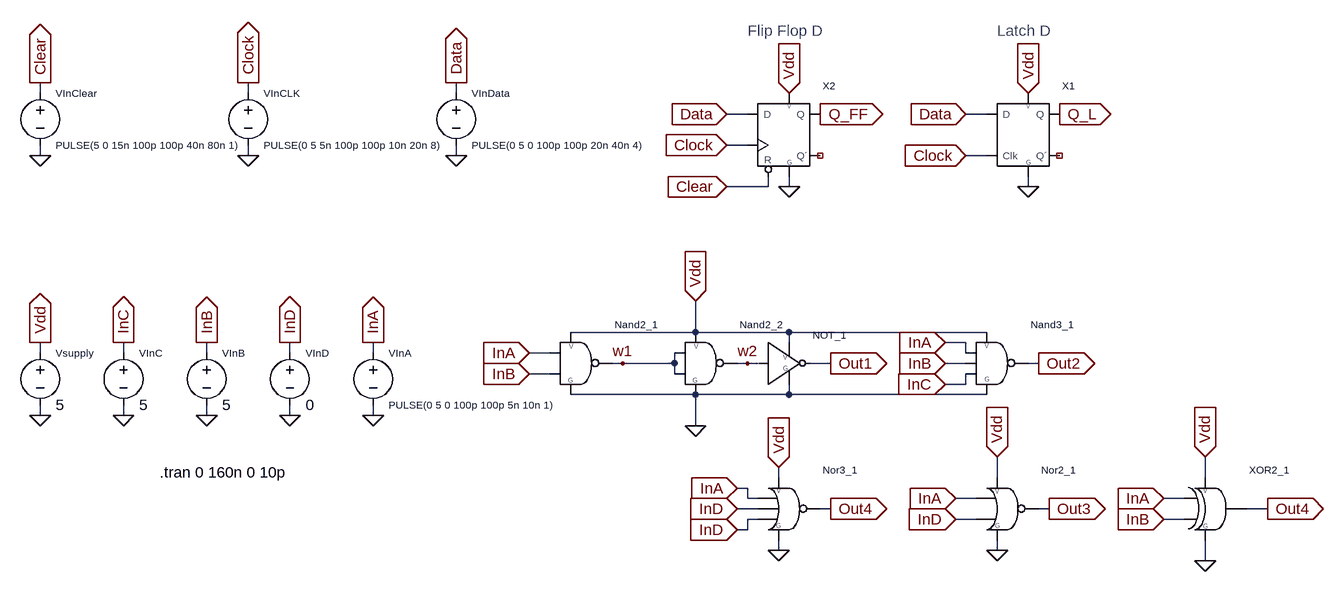
[diagram p0: schematic CircuitExample.asc]
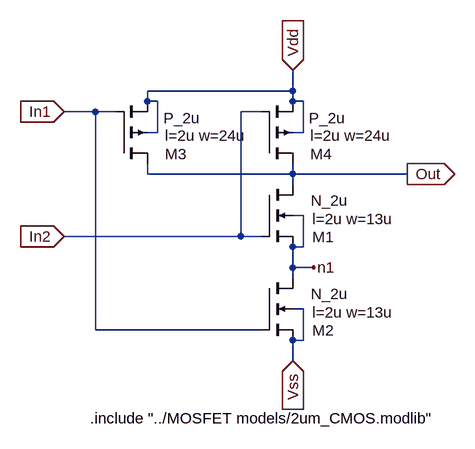
[diagram p1: sub-circuit nand2.asc]
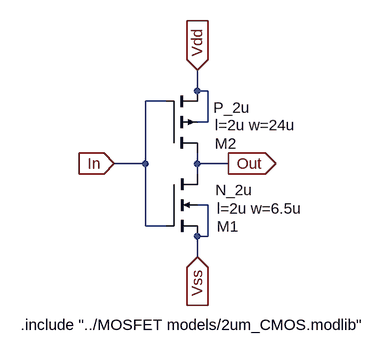
[diagram p2: sub-circuit not.asc]
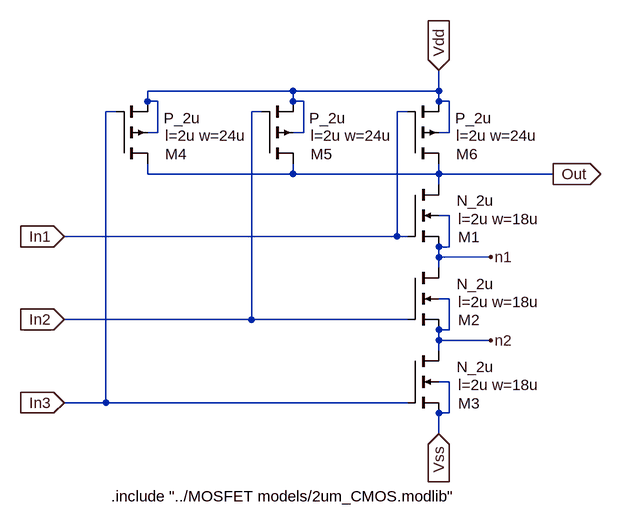
[diagram p3: sub-circuit nand3.asc]
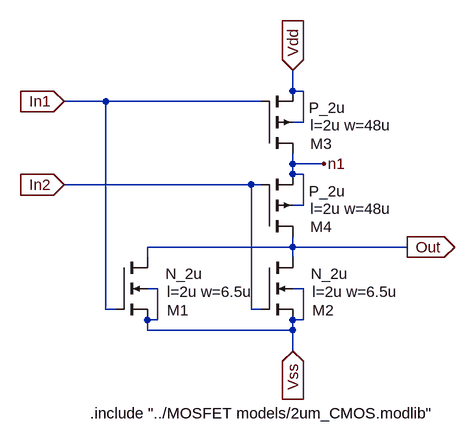
[diagram p4: sub-circuit nor2.asc]
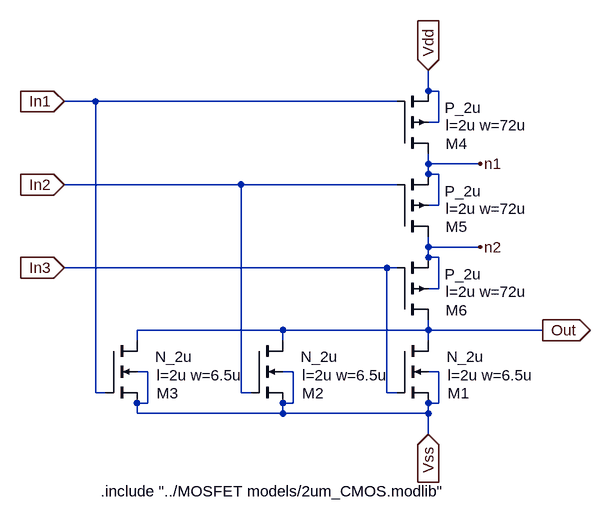
[diagram p5: sub-circuit nor3.asc]
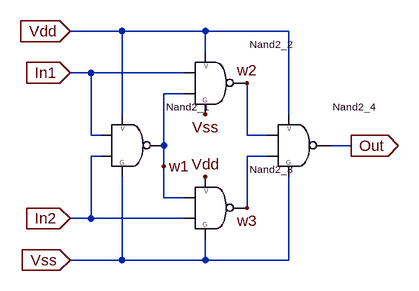
[diagram p6: sub-circuit xor2.asc]
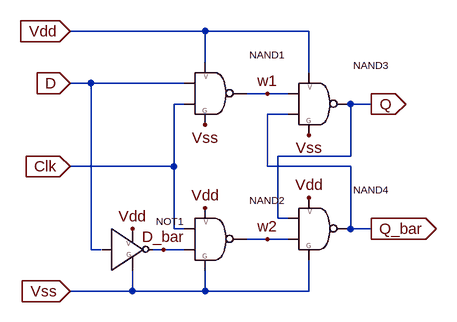
[diagram p7: sub-circuit d_latch.asc]
CircuitExample.asc, the LTspice schematic file:
Version 4
SHEET 1 1284 680
WIRE -784 -272 -784 -288
WIRE -464 -272 -464 -288
WIRE -144 -272 -144 -288
WIRE 304 -240 272 -240
WIRE 672 -240 640 -240
WIRE 304 -192 272 -192
WIRE -784 -176 -784 -192
WIRE -464 -176 -464 -192
WIRE -144 -176 -144 -192
WIRE 672 -176 640 -176
WIRE 336 -128 336 -144
WIRE 336 -128 272 -128
WIRE 368 -128 368 -144
WIRE 736 -128 736 -144
WIRE 224 96 224 48
WIRE 224 96 32 96
WIRE 368 96 224 96
WIRE 672 96 368 96
WIRE 368 112 368 96
WIRE 640 112 608 112
WIRE -784 128 -784 112
WIRE -656 128 -656 112
WIRE -528 128 -528 112
WIRE -400 128 -400 112
WIRE -272 128 -272 112
WIRE 0 128 -32 128
WIRE 640 128 640 112
WIRE 112 144 96 144
WIRE 192 144 192 128
WIRE 192 144 112 144
WIRE 304 144 288 144
WIRE 320 144 304 144
WIRE 432 144 400 144
WIRE 640 144 608 144
WIRE 752 144 736 144
WIRE 0 160 -32 160
WIRE 192 160 192 144
WIRE 640 176 640 160
WIRE 640 176 608 176
WIRE 224 192 32 192
WIRE 368 192 368 176
WIRE 368 192 224 192
WIRE 672 192 368 192
WIRE -784 224 -784 208
WIRE -656 224 -656 208
WIRE -528 224 -528 208
WIRE -400 224 -400 208
WIRE -272 224 -272 208
WIRE 224 240 224 192
WIRE 352 320 352 304
WIRE 688 320 688 288
WIRE 1008 320 1008 288
WIRE 304 336 288 336
WIRE 304 352 304 336
WIRE 320 352 304 352
WIRE 656 352 624 352
WIRE 976 352 944 352
WIRE 320 368 288 368
WIRE 432 368 416 368
WIRE 768 368 752 368
WIRE 1104 368 1072 368
WIRE 320 384 304 384
WIRE 656 384 624 384
WIRE 976 384 944 384
WIRE 304 400 304 384
WIRE 304 400 288 400
WIRE 352 432 352 416
WIRE 688 432 688 416
WIRE 1008 448 1008 416
FLAG 224 48 Vdd
IOPIN 224 48 In
FLAG 224 240 0
FLAG 112 144 w1
FLAG 304 144 w2
FLAG -32 128 InA
IOPIN -32 128 In
FLAG -32 160 InB
IOPIN -32 160 In
FLAG 432 144 Out1
IOPIN 432 144 Out
FLAG -784 224 0
FLAG -784 112 Vdd
IOPIN -784 112 Out
FLAG -528 224 0
FLAG -528 112 InB
IOPIN -528 112 Out
FLAG -272 224 0
FLAG -272 112 InA
IOPIN -272 112 Out
FLAG 608 112 InA
IOPIN 608 112 In
FLAG 608 144 InB
IOPIN 608 144 In
FLAG 608 176 InC
IOPIN 608 176 In
FLAG -656 224 0
FLAG -656 112 InC
IOPIN -656 112 Out
FLAG 752 144 Out2
IOPIN 752 144 Out
FLAG 688 288 Vdd
IOPIN 688 288 In
FLAG 688 432 0
FLAG 768 368 Out3
IOPIN 768 368 Out
FLAG 624 352 InA
IOPIN 624 352 In
FLAG 624 384 InD
IOPIN 624 384 In
FLAG -400 224 0
FLAG -400 112 InD
IOPIN -400 112 Out
FLAG 352 304 Vdd
IOPIN 352 304 In
FLAG 352 432 0
FLAG 432 368 Out4
IOPIN 432 368 Out
FLAG 288 336 InA
IOPIN 288 336 In
FLAG 288 368 InD
IOPIN 288 368 In
FLAG 288 400 InD
IOPIN 288 400 In
FLAG 944 352 InA
IOPIN 944 352 In
FLAG 944 384 InB
IOPIN 944 384 In
FLAG 1008 288 Vdd
IOPIN 1008 288 In
FLAG 1008 448 0
FLAG 1104 368 Out4
IOPIN 1104 368 Out
FLAG 368 -272 Vdd
IOPIN 368 -272 In
FLAG 736 -272 Vdd
IOPIN 736 -272 In
FLAG 368 -128 0
FLAG 736 -128 0
FLAG 416 -240 Q_FF
IOPIN 416 -240 Out
FLAG 784 -240 Q_L
IOPIN 784 -240 Out
FLAG -144 -176 0
FLAG -144 -288 Data
IOPIN -144 -288 Out
FLAG -464 -176 0
FLAG -464 -288 Clock
IOPIN -464 -288 Out
FLAG 272 -240 Data
IOPIN 272 -240 In
FLAG 640 -240 Data
IOPIN 640 -240 In
FLAG 272 -192 Clock
IOPIN 272 -192 In
FLAG 640 -176 Clock
IOPIN 640 -176 In
FLAG -784 -176 0
FLAG -784 -288 Clear
IOPIN -784 -288 Out
FLAG 272 -128 Clear
IOPIN 272 -128 In
SYMBOL NAND2 16 144 R0
SYMATTR InstName Nand2_1
SYMBOL NAND2 208 144 R0
SYMATTR InstName Nand2_2
SYMBOL NOT 336 144 R0
SYMATTR InstName NOT_1
SYMBOL voltage -784 112 R0
WINDOW 0 24 16 Left 1
WINDOW 123 0 0 Left 0
WINDOW 39 0 0 Left 0
SYMATTR InstName Vsupply
SYMATTR Value 5
SYMBOL voltage -528 112 R0
WINDOW 0 24 16 Left 1
WINDOW 123 0 0 Left 0
WINDOW 39 0 0 Left 0
SYMATTR InstName VInB
SYMATTR Value 5
SYMBOL voltage -272 112 R0
WINDOW 0 24 16 Left 1
WINDOW 3 24 96 Left 1
WINDOW 123 0 0 Left 0
WINDOW 39 0 0 Left 0
SYMATTR InstName VInA
SYMATTR Value PULSE(0 5 0 100p 100p 5n 10n 1)
SYMBOL NAND3 656 144 R0
SYMATTR InstName Nand3_1
SYMBOL voltage -656 112 R0
WINDOW 0 24 16 Left 1
WINDOW 123 0 0 Left 0
WINDOW 39 0 0 Left 0
SYMATTR InstName VInC
SYMATTR Value 5
SYMBOL NOR2 672 368 R0
SYMATTR InstName Nor2_1
SYMBOL voltage -400 112 R0
WINDOW 0 24 16 Left 1
WINDOW 123 0 0 Left 0
WINDOW 39 0 0 Left 0
SYMATTR InstName VInD
SYMATTR Value 0
SYMBOL NOR3 336 368 R0
SYMATTR InstName Nor3_1
SYMBOL XOR2 992 368 R0
SYMATTR InstName XOR2_1
SYMBOL D_latch 656 -208 R0
SYMATTR InstName X1
SYMBOL D_FF 288 -208 R0
SYMATTR InstName X2
SYMBOL voltage -144 -288 R0
WINDOW 0 24 16 Left 1
WINDOW 3 24 96 Left 1
WINDOW 123 0 0 Left 0
WINDOW 39 0 0 Left 0
SYMATTR InstName VInData
SYMATTR Value PULSE(0 5 0 100p 100p 20n 40n 4)
SYMBOL voltage -464 -288 R0
WINDOW 0 24 16 Left 1
WINDOW 3 24 96 Left 1
WINDOW 123 0 0 Left 0
WINDOW 39 0 0 Left 0
SYMATTR InstName VInCLK
SYMATTR Value PULSE(0 5 5n 100p 100p 10n 20n 8)
SYMBOL voltage -784 -288 R0
WINDOW 0 24 16 Left 1
WINDOW 3 24 96 Left 1
WINDOW 123 0 0 Left 0
WINDOW 39 0 0 Left 0
SYMATTR InstName VInClear
SYMATTR Value PULSE(5 0 15n 100p 100p 40n 80n 1)
TEXT -600 312 Left 2 !.tran 0 160n 0 10p
TEXT 304 -368 Left 2 ;Flip Flop D
TEXT 688 -368 Left 2 ;Latch D

nand2.asc, the sub-circuit schematic file:
Version 4
SHEET 1 880 680
WIRE 192 48 192 16
WIRE 192 48 -32 48
WIRE -32 64 -32 48
WIRE -16 64 -32 64
WIRE 192 64 192 48
WIRE 208 64 192 64
WIRE -112 80 -160 80
WIRE -80 80 -112 80
WIRE 144 80 112 80
WIRE -16 112 -16 64
WIRE -16 112 -32 112
WIRE 208 112 208 64
WIRE 208 112 192 112
WIRE -32 176 -32 160
WIRE 192 176 192 160
WIRE 192 176 -32 176
WIRE 368 176 192 176
WIRE 192 192 192 176
WIRE 208 240 192 240
WIRE 112 272 112 80
WIRE 112 272 -160 272
WIRE 144 272 112 272
WIRE 208 288 208 240
WIRE 208 288 192 288
WIRE 192 320 192 288
WIRE 224 320 192 320
WIRE 192 336 192 320
WIRE 208 384 192 384
WIRE -112 416 -112 80
WIRE 144 416 -112 416
WIRE 208 432 208 384
WIRE 208 432 192 432
WIRE 192 464 192 432
FLAG 192 16 Vdd
IOPIN 192 16 In
FLAG 192 464 Vss
IOPIN 192 464 In
FLAG -160 80 In1
IOPIN -160 80 In
FLAG -160 272 In2
IOPIN -160 272 In
FLAG 368 176 Out
IOPIN 368 176 Out
FLAG 224 320 n1
SYMBOL nmos4 144 192 R0
WINDOW 0 78 81 Left 2
WINDOW 3 76 25 Left 2
WINDOW 123 78 53 Left 2
SYMATTR InstName M1
SYMATTR Value N_2u
SYMATTR Value2 l=2u w=13u
SYMBOL pmos4 144 160 M180
WINDOW 0 75 15 Left 2
WINDOW 3 73 70 Left 2
WINDOW 123 75 43 Left 2
SYMATTR InstName M4
SYMATTR Value P_2u
SYMATTR Value2 l=2u w=24u
SYMBOL pmos4 -80 160 M180
WINDOW 0 75 15 Left 2
WINDOW 3 73 70 Left 2
WINDOW 123 75 43 Left 2
SYMATTR InstName M3
SYMATTR Value P_2u
SYMATTR Value2 l=2u w=24u
SYMBOL nmos4 144 336 R0
WINDOW 0 78 81 Left 2
WINDOW 3 76 25 Left 2
WINDOW 123 78 53 Left 2
SYMATTR InstName M2
SYMATTR Value N_2u
SYMATTR Value2 l=2u w=13u
TEXT -120 552 Left 2 !.include "../MOSFET models/2um_CMOS.modlib"

not.asc, the sub-circuit schematic file:
Version 4
SHEET 1 880 680
WIRE 192 64 192 32
WIRE 208 64 192 64
WIRE 144 80 112 80
WIRE 208 112 208 64
WIRE 208 112 192 112
WIRE 112 176 112 80
WIRE 112 176 64 176
WIRE 192 176 192 160
WIRE 240 176 192 176
WIRE 192 192 192 176
WIRE 208 240 192 240
WIRE 112 272 112 176
WIRE 144 272 112 272
WIRE 208 288 208 240
WIRE 208 288 192 288
WIRE 192 320 192 288
FLAG 192 32 Vdd
IOPIN 192 32 In
FLAG 192 320 Vss
IOPIN 192 320 In
FLAG 64 176 In
IOPIN 64 176 In
FLAG 240 176 Out
IOPIN 240 176 Out
SYMBOL nmos4 144 192 R0
WINDOW 0 78 81 Left 2
WINDOW 3 76 25 Left 2
WINDOW 123 78 53 Left 2
SYMATTR InstName M1
SYMATTR Value N_2u
SYMATTR Value2 l=2u w=6.5u
SYMBOL pmos4 144 160 M180
WINDOW 0 75 15 Left 2
WINDOW 3 73 70 Left 2
WINDOW 123 75 43 Left 2
SYMATTR InstName M2
SYMATTR Value P_2u
SYMATTR Value2 l=2u w=24u
TEXT -80 424 Left 2 !.include "../MOSFET models/2um_CMOS.modlib"

nand3.asc, the sub-circuit schematic file:
Version 4
SHEET 1 880 872
WIRE -32 48 -256 48
WIRE 192 48 192 16
WIRE 192 48 -32 48
WIRE -256 64 -256 48
WIRE -240 64 -256 64
WIRE -32 64 -32 48
WIRE -16 64 -32 64
WIRE 192 64 192 48
WIRE 208 64 192 64
WIRE -304 80 -320 80
WIRE -80 80 -96 80
WIRE 144 80 128 80
WIRE -240 112 -240 64
WIRE -240 112 -256 112
WIRE -16 112 -16 64
WIRE -16 112 -32 112
WIRE 208 112 208 64
WIRE 208 112 192 112
WIRE -256 176 -256 160
WIRE -32 176 -32 160
WIRE -32 176 -256 176
WIRE 192 176 192 160
WIRE 192 176 -32 176
WIRE 368 176 192 176
WIRE 192 192 192 176
WIRE 208 240 192 240
WIRE 128 272 128 80
WIRE 128 272 -384 272
WIRE 144 272 128 272
WIRE 208 288 208 240
WIRE 208 288 192 288
WIRE 192 304 192 288
WIRE 272 304 192 304
WIRE 192 320 192 304
WIRE 208 368 192 368
WIRE -96 400 -96 80
WIRE -96 400 -384 400
WIRE 144 400 -96 400
WIRE 208 416 208 368
WIRE 208 416 192 416
WIRE 192 432 192 416
WIRE 272 432 192 432
WIRE 192 448 192 432
WIRE 208 496 192 496
WIRE -320 528 -320 80
WIRE -320 528 -384 528
WIRE 144 528 -320 528
WIRE 208 544 208 496
WIRE 208 544 192 544
WIRE 192 576 192 544
FLAG 192 16 Vdd
IOPIN 192 16 In
FLAG 192 576 Vss
IOPIN 192 576 In
FLAG -384 272 In1
IOPIN -384 272 In
FLAG -384 400 In2
IOPIN -384 400 In
FLAG 368 176 Out
IOPIN 368 176 Out
FLAG -384 528 In3
IOPIN -384 528 In
FLAG 272 304 n1
FLAG 272 432 n2
SYMBOL nmos4 144 192 R0
WINDOW 0 78 81 Left 2
WINDOW 3 76 25 Left 2
WINDOW 123 78 53 Left 2
SYMATTR InstName M1
SYMATTR Value N_2u
SYMATTR Value2 l=2u w=18u
SYMBOL pmos4 144 160 M180
WINDOW 0 75 15 Left 2
WINDOW 3 73 70 Left 2
WINDOW 123 75 43 Left 2
SYMATTR InstName M6
SYMATTR Value P_2u
SYMATTR Value2 l=2u w=24u
SYMBOL pmos4 -80 160 M180
WINDOW 0 75 15 Left 2
WINDOW 3 73 70 Left 2
WINDOW 123 75 43 Left 2
SYMATTR InstName M5
SYMATTR Value P_2u
SYMATTR Value2 l=2u w=24u
SYMBOL nmos4 144 448 R0
WINDOW 0 78 81 Left 2
WINDOW 3 76 25 Left 2
WINDOW 123 78 53 Left 2
SYMATTR InstName M3
SYMATTR Value N_2u
SYMATTR Value2 l=2u w=18u
SYMBOL pmos4 -304 160 M180
WINDOW 0 75 15 Left 2
WINDOW 3 73 70 Left 2
WINDOW 123 75 43 Left 2
SYMATTR InstName M4
SYMATTR Value P_2u
SYMATTR Value2 l=2u w=24u
SYMBOL nmos4 144 320 R0
WINDOW 0 78 81 Left 2
WINDOW 3 76 25 Left 2
WINDOW 123 78 53 Left 2
SYMATTR InstName M2
SYMATTR Value N_2u
SYMATTR Value2 l=2u w=18u
TEXT -312 672 Left 2 !.include "../MOSFET models/2um_CMOS.modlib"

nor2.asc, the sub-circuit schematic file:
Version 4
SHEET 1 880 680
WIRE 192 -64 192 -96
WIRE 208 -64 192 -64
WIRE -96 -48 -160 -48
WIRE 144 -48 -96 -48
WIRE 208 -16 208 -64
WIRE 208 -16 192 -16
WIRE 192 48 192 32
WIRE 240 48 192 48
WIRE 192 64 192 48
WIRE 208 64 192 64
WIRE 128 80 -160 80
WIRE 144 80 128 80
WIRE 208 112 208 64
WIRE 208 112 192 112
WIRE 192 176 192 160
WIRE 192 176 -32 176
WIRE 368 176 192 176
WIRE -32 192 -32 176
WIRE 192 192 192 176
WIRE -16 240 -32 240
WIRE 208 240 192 240
WIRE -96 272 -96 -48
WIRE -80 272 -96 272
WIRE 128 272 128 80
WIRE 144 272 128 272
WIRE -16 288 -16 240
WIRE -16 288 -32 288
WIRE 208 288 208 240
WIRE 208 288 192 288
WIRE -32 304 -32 288
WIRE 192 304 192 288
WIRE 192 304 -32 304
WIRE 192 336 192 304
FLAG 192 -96 Vdd
IOPIN 192 -96 In
FLAG 192 336 Vss
IOPIN 192 336 In
FLAG -160 -48 In1
IOPIN -160 -48 In
FLAG -160 80 In2
IOPIN -160 80 In
FLAG 368 176 Out
IOPIN 368 176 Out
FLAG 240 48 n1
SYMBOL nmos4 144 192 R0
WINDOW 0 78 81 Left 2
WINDOW 3 76 25 Left 2
WINDOW 123 78 53 Left 2
SYMATTR InstName M2
SYMATTR Value N_2u
SYMATTR Value2 l=2u w=6.5u
SYMBOL pmos4 144 160 M180
WINDOW 0 75 15 Left 2
WINDOW 3 73 70 Left 2
WINDOW 123 75 43 Left 2
SYMATTR InstName M4
SYMATTR Value P_2u
SYMATTR Value2 l=2u w=48u
SYMBOL pmos4 144 32 M180
WINDOW 0 75 15 Left 2
WINDOW 3 73 70 Left 2
WINDOW 123 75 43 Left 2
SYMATTR InstName M3
SYMATTR Value P_2u
SYMATTR Value2 l=2u w=48u
SYMBOL nmos4 -80 192 R0
WINDOW 0 78 81 Left 2
WINDOW 3 76 25 Left 2
WINDOW 123 78 53 Left 2
SYMATTR InstName M1
SYMATTR Value N_2u
SYMATTR Value2 l=2u w=6.5u
TEXT -120 432 Left 2 !.include "../MOSFET models/2um_CMOS.modlib"

nor3.asc, the sub-circuit schematic file:
Version 4
SHEET 1 880 872
WIRE 192 -192 192 -224
WIRE 208 -192 192 -192
WIRE -320 -176 -368 -176
WIRE 144 -176 -320 -176
WIRE 208 -144 208 -192
WIRE 208 -144 192 -144
WIRE 192 -80 192 -96
WIRE 272 -80 192 -80
WIRE 192 -64 192 -80
WIRE 208 -64 192 -64
WIRE -96 -48 -368 -48
WIRE 144 -48 -96 -48
WIRE 208 -16 208 -64
WIRE 208 -16 192 -16
WIRE 192 48 192 32
WIRE 272 48 192 48
WIRE 192 64 192 48
WIRE 208 64 192 64
WIRE 128 80 -368 80
WIRE 144 80 128 80
WIRE 208 112 208 64
WIRE 208 112 192 112
WIRE -32 176 -256 176
WIRE 192 176 192 160
WIRE 192 176 -32 176
WIRE 368 176 192 176
WIRE -256 192 -256 176
WIRE -32 192 -32 176
WIRE 192 192 192 176
WIRE -240 240 -256 240
WIRE -16 240 -32 240
WIRE 208 240 192 240
WIRE -320 272 -320 -176
WIRE -304 272 -320 272
WIRE -96 272 -96 -48
WIRE -80 272 -96 272
WIRE 128 272 128 80
WIRE 144 272 128 272
WIRE -240 288 -240 240
WIRE -240 288 -256 288
WIRE -16 288 -16 240
WIRE -16 288 -32 288
WIRE 208 288 208 240
WIRE 208 288 192 288
WIRE -256 304 -256 288
WIRE -32 304 -32 288
WIRE -32 304 -256 304
WIRE 192 304 192 288
WIRE 192 304 -32 304
WIRE 192 336 192 304
FLAG 192 -224 Vdd
IOPIN 192 -224 In
FLAG 192 336 Vss
IOPIN 192 336 In
FLAG -368 -176 In1
IOPIN -368 -176 In
FLAG -368 -48 In2
IOPIN -368 -48 In
FLAG 368 176 Out
IOPIN 368 176 Out
FLAG -368 80 In3
IOPIN -368 80 In
FLAG 272 -80 n1
FLAG 272 48 n2
SYMBOL nmos4 144 192 R0
WINDOW 0 78 81 Left 2
WINDOW 3 76 25 Left 2
WINDOW 123 78 53 Left 2
SYMATTR InstName M1
SYMATTR Value N_2u
SYMATTR Value2 l=2u w=6.5u
SYMBOL pmos4 144 160 M180
WINDOW 0 75 15 Left 2
WINDOW 3 73 70 Left 2
WINDOW 123 75 43 Left 2
SYMATTR InstName M6
SYMATTR Value P_2u
SYMATTR Value2 l=2u w=72u
SYMBOL pmos4 144 32 M180
WINDOW 0 75 15 Left 2
WINDOW 3 73 70 Left 2
WINDOW 123 75 43 Left 2
SYMATTR InstName M5
SYMATTR Value P_2u
SYMATTR Value2 l=2u w=72u
SYMBOL nmos4 -304 192 R0
WINDOW 0 78 81 Left 2
WINDOW 3 76 25 Left 2
WINDOW 123 78 53 Left 2
SYMATTR InstName M3
SYMATTR Value N_2u
SYMATTR Value2 l=2u w=6.5u
SYMBOL pmos4 144 -96 M180
WINDOW 0 75 15 Left 2
WINDOW 3 73 70 Left 2
WINDOW 123 75 43 Left 2
SYMATTR InstName M4
SYMATTR Value P_2u
SYMATTR Value2 l=2u w=72u
SYMBOL nmos4 -80 192 R0
WINDOW 0 78 81 Left 2
WINDOW 3 76 25 Left 2
WINDOW 123 78 53 Left 2
SYMATTR InstName M2
SYMATTR Value N_2u
SYMATTR Value2 l=2u w=6.5u
TEXT -312 424 Left 2 !.include "../MOSFET models/2um_CMOS.modlib"

xor2.asc, the sub-circuit schematic file:
Version 4
SHEET 1 880 680
WIRE -48 -80 -128 -80
WIRE 80 -80 -48 -80
WIRE 208 -80 80 -80
WIRE 80 -48 80 -80
WIRE -96 -16 -128 -16
WIRE 48 -16 -96 -16
WIRE 48 16 16 16
WIRE -48 48 -48 -80
WIRE 208 48 208 -80
WIRE -96 80 -96 -16
WIRE -80 80 -96 80
WIRE 144 80 144 0
WIRE 176 80 144 80
WIRE 16 96 16 16
WIRE 304 96 272 96
WIRE -80 112 -96 112
WIRE 176 112 144 112
WIRE 16 128 16 96
WIRE 16 176 16 128
WIRE 48 176 16 176
WIRE 144 192 144 112
WIRE -96 208 -96 112
WIRE -96 208 -128 208
WIRE 48 208 -96 208
WIRE -48 272 -48 144
WIRE -48 272 -128 272
WIRE 80 272 80 240
WIRE 80 272 -48 272
WIRE 208 272 208 144
WIRE 208 272 80 272
FLAG -128 -80 Vdd
IOPIN -128 -80 In
FLAG -128 272 Vss
IOPIN -128 272 In
FLAG -128 -16 In1
IOPIN -128 -16 In
FLAG -128 208 In2
IOPIN -128 208 In
FLAG 304 96 Out
IOPIN 304 96 Out
FLAG 80 144 Vdd
FLAG 80 48 Vss
FLAG 16 128 w1
FLAG 144 0 w2
FLAG 144 192 w3
SYMBOL NAND2 -64 96 R0
SYMATTR InstName Nand2_1
SYMBOL NAND2 64 0 R0
SYMATTR InstName Nand2_2
SYMBOL NAND2 64 192 R0
SYMATTR InstName Nand2_3
SYMBOL NAND2 192 96 R0
SYMATTR InstName Nand2_4

d_latch.asc, the sub-circuit schematic file:
Version 4
SHEET 1 880 680
WIRE 320 -16 112 -16
WIRE 480 -16 320 -16
WIRE 320 32 320 -16
WIRE 480 48 480 -16
WIRE 144 64 112 64
WIRE 288 64 144 64
WIRE 416 80 384 80
WIRE 448 80 416 80
WIRE 288 96 272 96
WIRE 576 96 544 96
WIRE 448 112 416 112
WIRE 544 176 544 96
WIRE 544 176 432 176
WIRE 272 192 272 96
WIRE 272 192 112 192
WIRE 416 192 416 112
WIRE 544 192 416 192
WIRE 432 272 432 176
WIRE 448 272 432 272
WIRE 272 288 272 192
WIRE 288 288 272 288
WIRE 544 288 544 192
WIRE 576 288 544 288
WIRE 416 304 384 304
WIRE 448 304 416 304
WIRE 144 320 144 64
WIRE 160 320 144 320
WIRE 256 320 240 320
WIRE 288 320 256 320
WIRE 208 384 208 352
WIRE 208 384 112 384
WIRE 320 384 320 352
WIRE 320 384 208 384
WIRE 480 384 480 336
WIRE 480 384 320 384
FLAG 112 64 D
IOPIN 112 64 In
FLAG 112 192 Clk
IOPIN 112 192 In
FLAG 112 -16 Vdd
IOPIN 112 -16 In
FLAG 112 384 Vss
IOPIN 112 384 In
FLAG 320 128 Vss
FLAG 480 144 Vss
FLAG 208 288 Vdd
FLAG 320 256 Vdd
FLAG 480 240 Vdd
FLAG 576 96 Q
IOPIN 576 96 Out
FLAG 576 288 Q_bar
IOPIN 576 288 Out
FLAG 256 320 D_bar
FLAG 416 80 w1
FLAG 416 304 w2
SYMBOL NOT 176 320 R0
SYMATTR InstName NOT1
SYMBOL NAND2 304 80 R0
SYMATTR InstName NAND1
SYMBOL NAND2 304 304 R0
SYMATTR InstName NAND2
SYMBOL NAND2 464 96 R0
SYMATTR InstName NAND3
SYMBOL NAND2 464 288 R0
SYMATTR InstName NAND4

d_ff.asc, the sub-circuit schematic file:
Version 4
SHEET 1 904 680
WIRE 288 -176 112 -176
WIRE 480 -176 288 -176
WIRE 288 -160 288 -176
WIRE 256 -128 208 -128
WIRE 256 -96 224 -96
WIRE 352 -32 352 -112
WIRE 352 -32 240 -32
WIRE 224 -16 224 -96
WIRE 352 -16 224 -16
WIRE 480 48 480 -176
WIRE 240 64 240 -32
WIRE 256 64 240 64
WIRE 256 80 176 80
WIRE 352 80 352 -16
WIRE 400 80 352 80
WIRE 448 80 400 80
WIRE 256 96 144 96
WIRE 576 96 544 96
WIRE 448 112 416 112
WIRE 352 176 352 80
WIRE 352 176 240 176
WIRE 544 176 544 96
WIRE 544 176 432 176
WIRE 144 192 144 96
WIRE 144 192 112 192
WIRE 416 192 416 112
WIRE 544 192 416 192
WIRE 432 272 432 176
WIRE 448 272 432 272
WIRE 240 288 240 176
WIRE 256 288 240 288
WIRE 448 288 432 288
WIRE 544 288 544 192
WIRE 576 288 544 288
WIRE 144 304 144 192
WIRE 256 304 144 304
WIRE 400 304 352 304
WIRE 448 304 400 304
WIRE 256 320 224 320
WIRE 352 384 352 304
WIRE 352 384 240 384
WIRE 224 400 224 320
WIRE 352 400 224 400
WIRE 240 480 240 384
WIRE 256 480 240 480
WIRE 256 496 112 496
WIRE 352 496 352 400
WIRE 176 512 176 80
WIRE 256 512 176 512
WIRE 176 544 176 512
WIRE 176 544 112 544
WIRE 208 560 208 -128
WIRE 352 560 352 496
WIRE 352 560 208 560
WIRE 176 576 176 544
WIRE 432 576 432 288
WIRE 432 576 176 576
WIRE 288 608 288 544
WIRE 288 608 96 608
WIRE 480 608 480 336
WIRE 480 608 288 608
FLAG 112 496 D
IOPIN 112 496 In
FLAG 112 192 Clk
IOPIN 112 192 In
FLAG 112 -176 Vdd
IOPIN 112 -176 In
FLAG 96 608 Vss
IOPIN 96 608 In
FLAG 576 96 Q
IOPIN 576 96 Out
FLAG 576 288 Q_bar
IOPIN 576 288 Out
FLAG 400 80 S
FLAG 400 304 R
FLAG 112 544 Clear_n
IOPIN 112 544 In
FLAG 288 32 Vdd
FLAG 288 256 Vdd
FLAG 480 240 Vdd
FLAG 288 448 Vdd
FLAG 288 -64 Vss
FLAG 288 128 Vss
FLAG 480 144 Vss
FLAG 288 352 Vss
SYMBOL NAND2 464 96 R0
SYMATTR InstName NAND5
SYMBOL NAND2 272 -112 R0
SYMATTR InstName NAND1
SYMBOL NAND3 272 496 R0
SYMATTR InstName NAND4
SYMBOL NAND3 272 304 R0
SYMATTR InstName NAND3
SYMBOL NAND3 272 80 R0
SYMATTR InstName NAND2
SYMBOL NAND3 464 288 R0
SYMATTR InstName NAND6

The netlist it stands for:
* CircuitExample.asc
XNand2_1 InA InB w1 Vdd 0 nand2
XNand2_2 w1 w1 w2 Vdd 0 nand2
XNOT_1 w2 Out1 Vdd 0 not
Vsupply Vdd 0 5
VInB InB 0 5
VInA InA 0 PULSE(0 5 0 100p 100p 5n 10n 1)
XNand3_1 InA InC InB Out2 Vdd 0 nand3
VInC InC 0 5
XNor2_1 InA InD Out3 Vdd 0 nor2
VInD InD 0 0
XNor3_1 InA InD InD Out4 Vdd 0 nor3
XXOR2_1 InA InB Out4 Vdd 0 xor2
XX1 Data Clock Q_L NC_01 Vdd 0 d_latch
XX2 Data Clock Clear Q_FF NC_02 Vdd 0 d_ff
VInData Data 0 PULSE(0 5 0 100p 100p 20n 40n 4)
VInCLK Clock 0 PULSE(0 5 5n 100p 100p 10n 20n 8)
VInClear Clear 0 PULSE(5 0 15n 100p 100p 40n 80n 1)

* block symbol definitions
.subckt nand2 In1 In2 Out Vdd Vss
M1 Out In2 n1 n1 N_2u l=2u w=13u
M4 Out In2 Vdd Vdd P_2u l=2u w=24u
M3 Out In1 Vdd Vdd P_2u l=2u w=24u
M2 n1 In1 Vss Vss N_2u l=2u w=13u
.include "../MOSFET models/2um_CMOS.modlib"
.ends nand2

.subckt not In Out Vdd Vss
M1 Out In Vss Vss N_2u l=2u w=6.5u
M2 Out In Vdd Vdd P_2u l=2u w=24u
.include "../MOSFET models/2um_CMOS.modlib"
.ends not

.subckt nand3 In1 In2 In3 Out Vdd Vss
M1 Out In1 n1 n1 N_2u l=2u w=18u
M6 Out In1 Vdd Vdd P_2u l=2u w=24u
M5 Out In2 Vdd Vdd P_2u l=2u w=24u
M3 n2 In3 Vss Vss N_2u l=2u w=18u
M4 Out In3 Vdd Vdd P_2u l=2u w=24u
M2 n1 In2 n2 n2 N_2u l=2u w=18u
.include "../MOSFET models/2um_CMOS.modlib"
.ends nand3

.subckt nor2 In1 In2 Out Vdd Vss
M2 Out In2 Vss Vss N_2u l=2u w=6.5u
M4 Out In2 n1 n1 P_2u l=2u w=48u
M3 n1 In1 Vdd Vdd P_2u l=2u w=48u
M1 Out In1 Vss Vss N_2u l=2u w=6.5u
.include "../MOSFET models/2um_CMOS.modlib"
.ends nor2

.subckt nor3 In1 In2 In3 Out Vdd Vss
M1 Out In3 Vss Vss N_2u l=2u w=6.5u
M6 Out In3 n2 n2 P_2u l=2u w=72u
M5 n2 In2 n1 n1 P_2u l=2u w=72u
M3 Out In1 Vss Vss N_2u l=2u w=6.5u
M4 n1 In1 Vdd Vdd P_2u l=2u w=72u
M2 Out In2 Vss Vss N_2u l=2u w=6.5u
.include "../MOSFET models/2um_CMOS.modlib"
.ends nor3

.subckt xor2 In1 In2 Out Vdd Vss
XNand2_1 In1 In2 w1 Vdd Vss nand2
XNand2_2 In1 w1 w2 Vdd Vss nand2
XNand2_3 w1 In2 w3 Vdd Vss nand2
XNand2_4 w2 w3 Out Vdd Vss nand2
.ends xor2

.subckt d_latch D Clk Q Q_bar Vdd Vss
XNOT1 D D_bar Vdd Vss not
XNAND1 D Clk w1 Vdd Vss nand2
XNAND2 Clk D_bar w2 Vdd Vss nand2
XNAND3 w1 Q_bar Q Vdd Vss nand2
XNAND4 Q w2 Q_bar Vdd Vss nand2
.ends d_latch

.subckt d_ff D Clk Clear_n Q Q_bar Vdd Vss
XNAND5 S Q_bar Q Vdd Vss nand2
XNAND1 N001 S N002 Vdd Vss nand2
XNAND4 R Clear_n D N001 Vdd Vss nand3
XNAND3 S N001 Clk R Vdd Vss nand3
XNAND2 N002 Clk Clear_n S Vdd Vss nand3
XNAND6 Q R Clear_n Q_bar Vdd Vss nand3
.ends d_ff

.model NMOS NMOS
.model PMOS PMOS
.lib standard.mos
.tran 0 160n 0 10p
* Flip Flop D
* Latch D
.backanno
.end